# EAGLE schematic main (EAGLE 6.4)
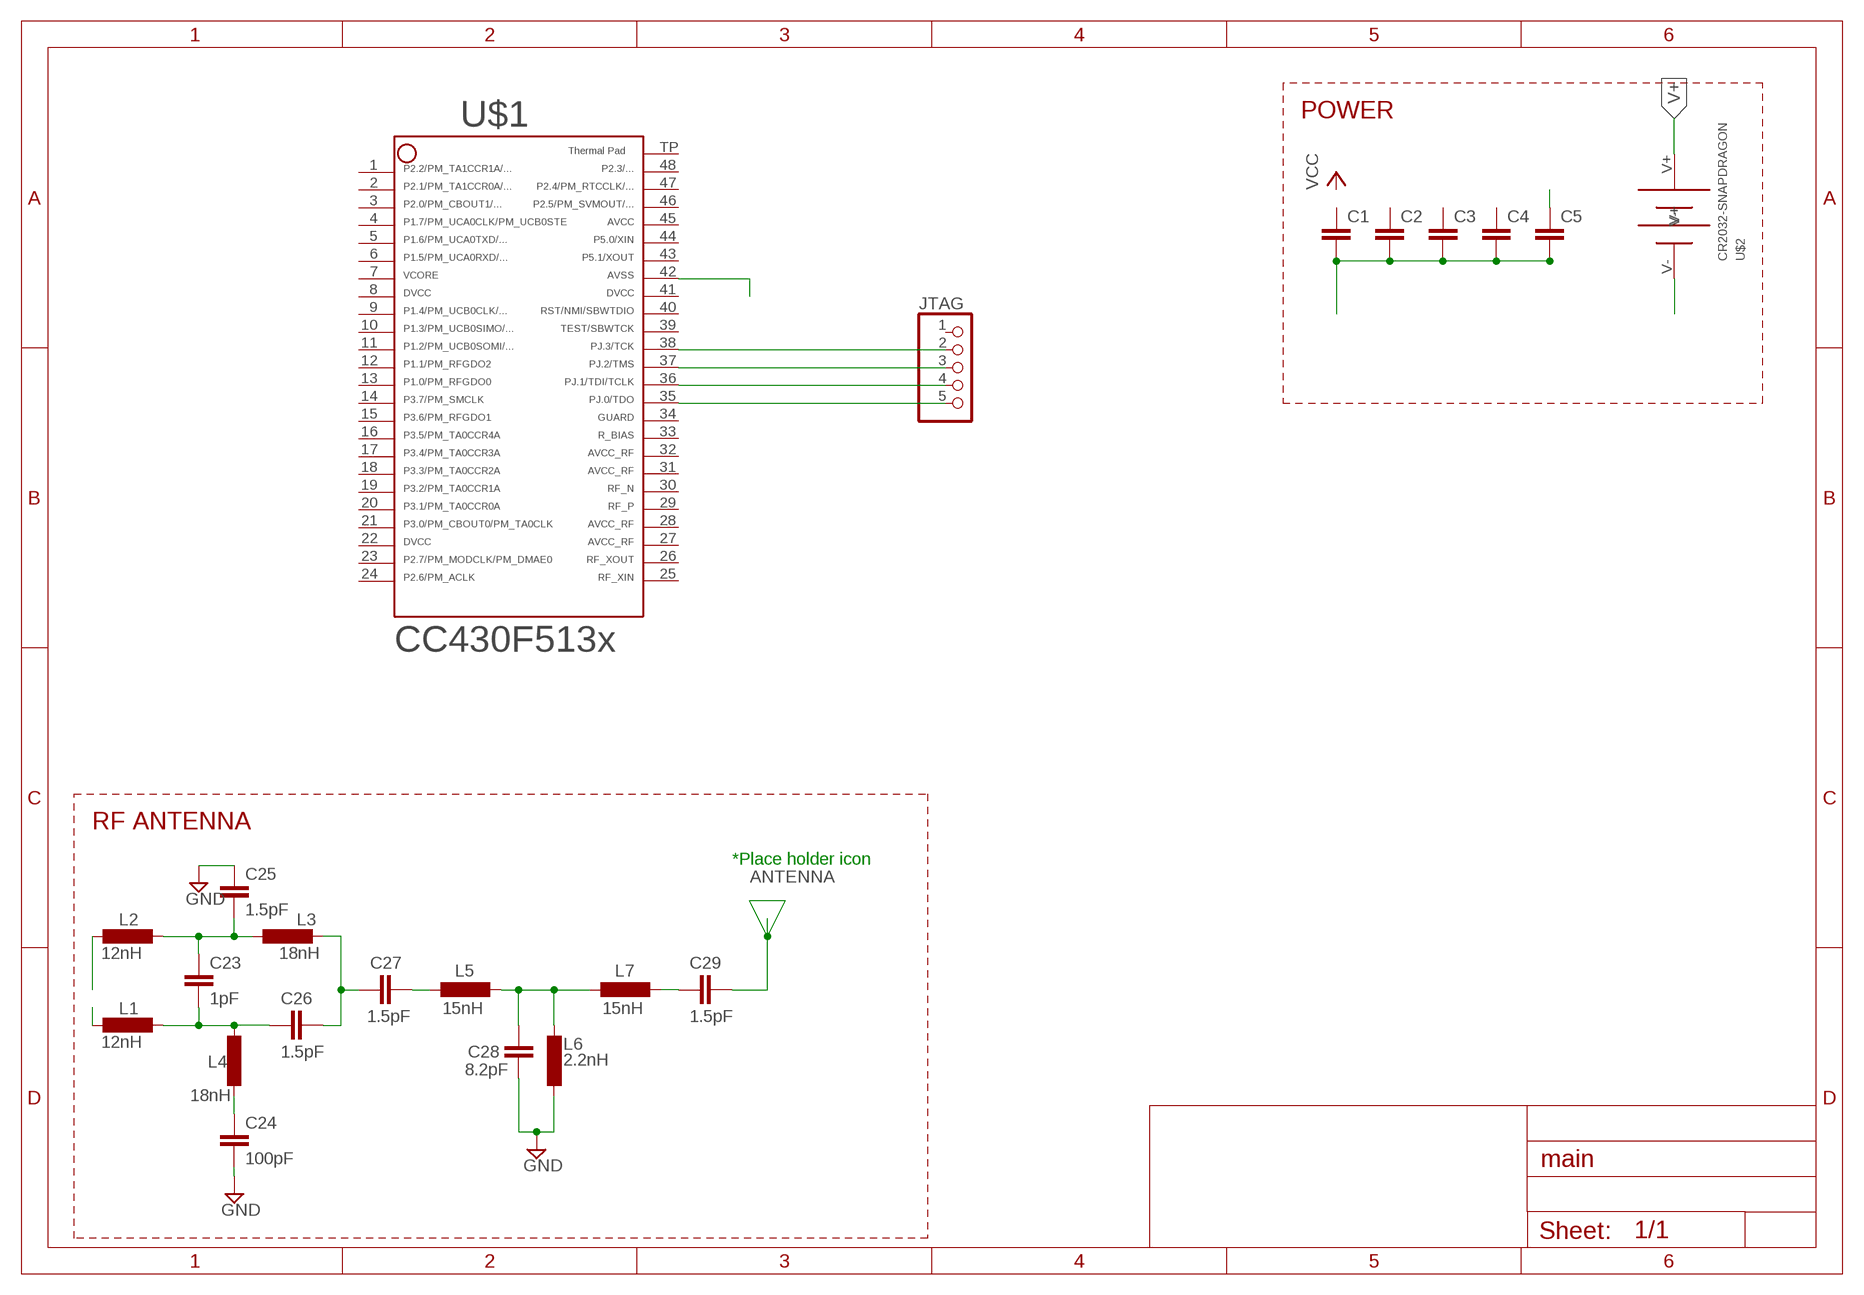
[diagram p0: schematic, sheet 1]

## Parts
C1  C-EUC0603  [C0603]
C2  C-EUC0603  [C0603]
C3  C-EUC0603  [C0603]
C4  C-EUC0603  [C0603]
C5  C-EUC0603  [C0603]
C23  1pF  C-EUC0603  [C0603]
C24  100pF  C-EUC0603  [C0603]
C25  1.5pF  C-EUC0603  [C0603]
C26  1.5pF  C-EUC0603  [C0603]
C27  1.5pF  C-EUC0603  [C0603]
C28  8.2pF  C-EUC0603  [C0603]
C29  1.5pF  C-EUC0603  [C0603]
JTAG  PINHD-1X5  [1X05]
L1  12nH  LL0603  [L0603]
L2  12nH  LL0603  [L0603]
L3  18nH  LL0603  [L0603]
L4  18nH  LL0603  [L0603]
L5  15nH  LL0603  [L0603]
L6  2.2nH  LL0603  [L0603]
L7  15nH  LL0603  [L0603]
U$1  CC430F513X---RGZ48  [RGZ48]
U$2  CR2032-SNAPDRAGON  [CR2032-SNAPDRAGON]

## Nets
ANTENNA: C29.1
GND: C24.2 C25.1 C28.1 L6.2 U$2.V-
N$1: C23.2 C26.2 L1.1 L4.1
N$2: C23.1 C25.2 L2.1 L3.2
N$3: C26.1 C27.1 L3.1
N$4: C24.1 L4.2
N$5: C27.2 L5.1
N$6: C28.2 L5.2 L6.1 L7.1
N$7: JTAG.3 U$1.37
N$8: C29.2 L7.2
N$9: U$1.42
N$10: C1.2 C2.2 C3.2 C4.2 C5.2
N$11: JTAG.2 U$1.38
N$12: JTAG.5 U$1.35
N$13: JTAG.4 U$1.36
N$17: C5.1
RF_N: L2.2
RF_P: L1.2
V+: U$2.V+
Unconnected: C1.1 C2.1 C3.1 C4.1 JTAG.1 U$1.1 U$1.2 U$1.3 U$1.4 U$1.5 U$1.6 U$1.9 U$1.10 U$1.11 U$1.12 U$1.13 U$1.14 U$1.15 U$1.16 U$1.17 U$1.18 U$1.19 U$1.20 U$1.21 U$1.23 U$1.24 U$1.25 U$1.26 U$1.28 U$1.29 U$1.30 U$1.39 U$1.40 U$1.43 U$1.44 U$1.45 U$1.46 U$1.47 U$1.48

## Notes on the sheet
- POWER
- RF ANTENNA
- *Place holder icon

## Power pins joined to a net without a drawn wire
7: U$1.7
8: U$1.8
22: U$1.22
27: U$1.27
31: U$1.31
32: U$1.32
33: U$1.33
34: U$1.34
41: U$1.41
49: U$1.TP

## Library data of the parts
C1-C5 C23-C29 = rcl:C-EU: CAPACITOR, European symbol
JTAG = aMJK_General:PINHD-1X5: PIN HEADER
L1-L7 = rcl-amber:L
U$1 = TI_MSP430_v16:CC430F513X---RGZ48: ***CC430F513X***RGZ48 ** ** Rev 1.0 ** 06/2010 * http://focus.ti.com/docs/prod/folders/print/cc430f5137.html
U$2 = CR2032-SnapDragon:CR2032-SNAPDRAGON: HOLDER SNAP DRAGON CR2032 SMD Digikey P/N: BHSD-2032-SMCT-ND